# Altium schematic sheet aio_conn.SchDoc
size A
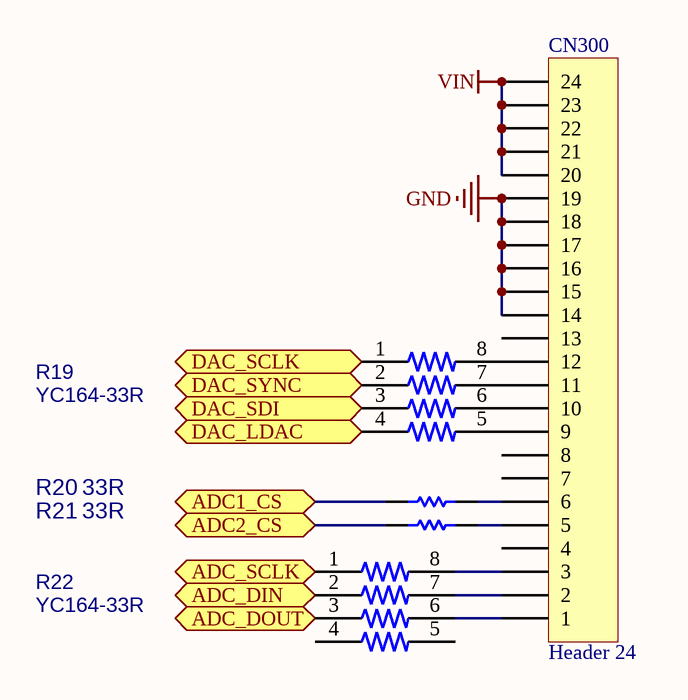
[diagram p0: aio_conn.SchDoc]

## Parts
CN300  Header 24  [FPC-0.5-24]
R19  YC164-33R  [YC164]
R20  33R  [R0603]
R21  33R  [R0603]
R22  YC164-33R  [YC164]

## Ports
ADC1_CS, ADC2_CS, ADC_DIN, ADC_DOUT, ADC_SCLK, DAC_LDAC, DAC_SCLK, DAC_SDI, DAC_SYNC

## Nets
GND: CN300.14 CN300.15 CN300.16 CN300.17 CN300.18 CN300.19
VIN: CN300.20 CN300.21 CN300.22 CN300.23 CN300.24
ADC1_CS: R20.2 ; port ADC1_CS
ADC2_CS: R21.2 ; port ADC2_CS
ADC_DIN: R22.2 ; port ADC_DIN
ADC_DOUT: R22.3 ; port ADC_DOUT
ADC_SCLK: R22.1 ; port ADC_SCLK
DAC_LDAC: R19.4 ; port DAC_LDAC
DAC_SCLK: R19.1 ; port DAC_SCLK
DAC_SDI: R19.3 ; port DAC_SDI
DAC_SYNC: R19.2 ; port DAC_SYNC
NetCN300_1: CN300.1 R22.6
NetCN300_2: CN300.2 R22.7
NetCN300_3: CN300.3 R22.8
NetCN300_5: CN300.5 R21.1
NetCN300_6: CN300.6 R20.1
NetCN300_9: CN300.9 R19.5
NetCN300_10: CN300.10 R19.6
NetCN300_11: CN300.11 R19.7
NetCN300_12: CN300.12 R19.8

Not connected (* = marked no-connect by the designer): CN300 4 7 8 13; R22 4 5

## Library data of the parts
CN300 = Header 24: Header, 24-Pin; LatestRevisionDate: 17-Jul-2002; LatestRevisionNote: Re-released for DXP Platform.; Publisher: Altium Limited
R19 R22 = YC164
R20 R21 = Res1: Resistor; Published: 8-Jun-2000; LatestRevisionDate: 17-Jul-2002; LatestRevisionNote: Re-released for DXP Platform.; PackageReference: AXIAL-0.3; Publisher: Altium Limited; PackageDescription: Axial Device, Thru-Hole; 2 Leads; 0.3 in Pin Spacing